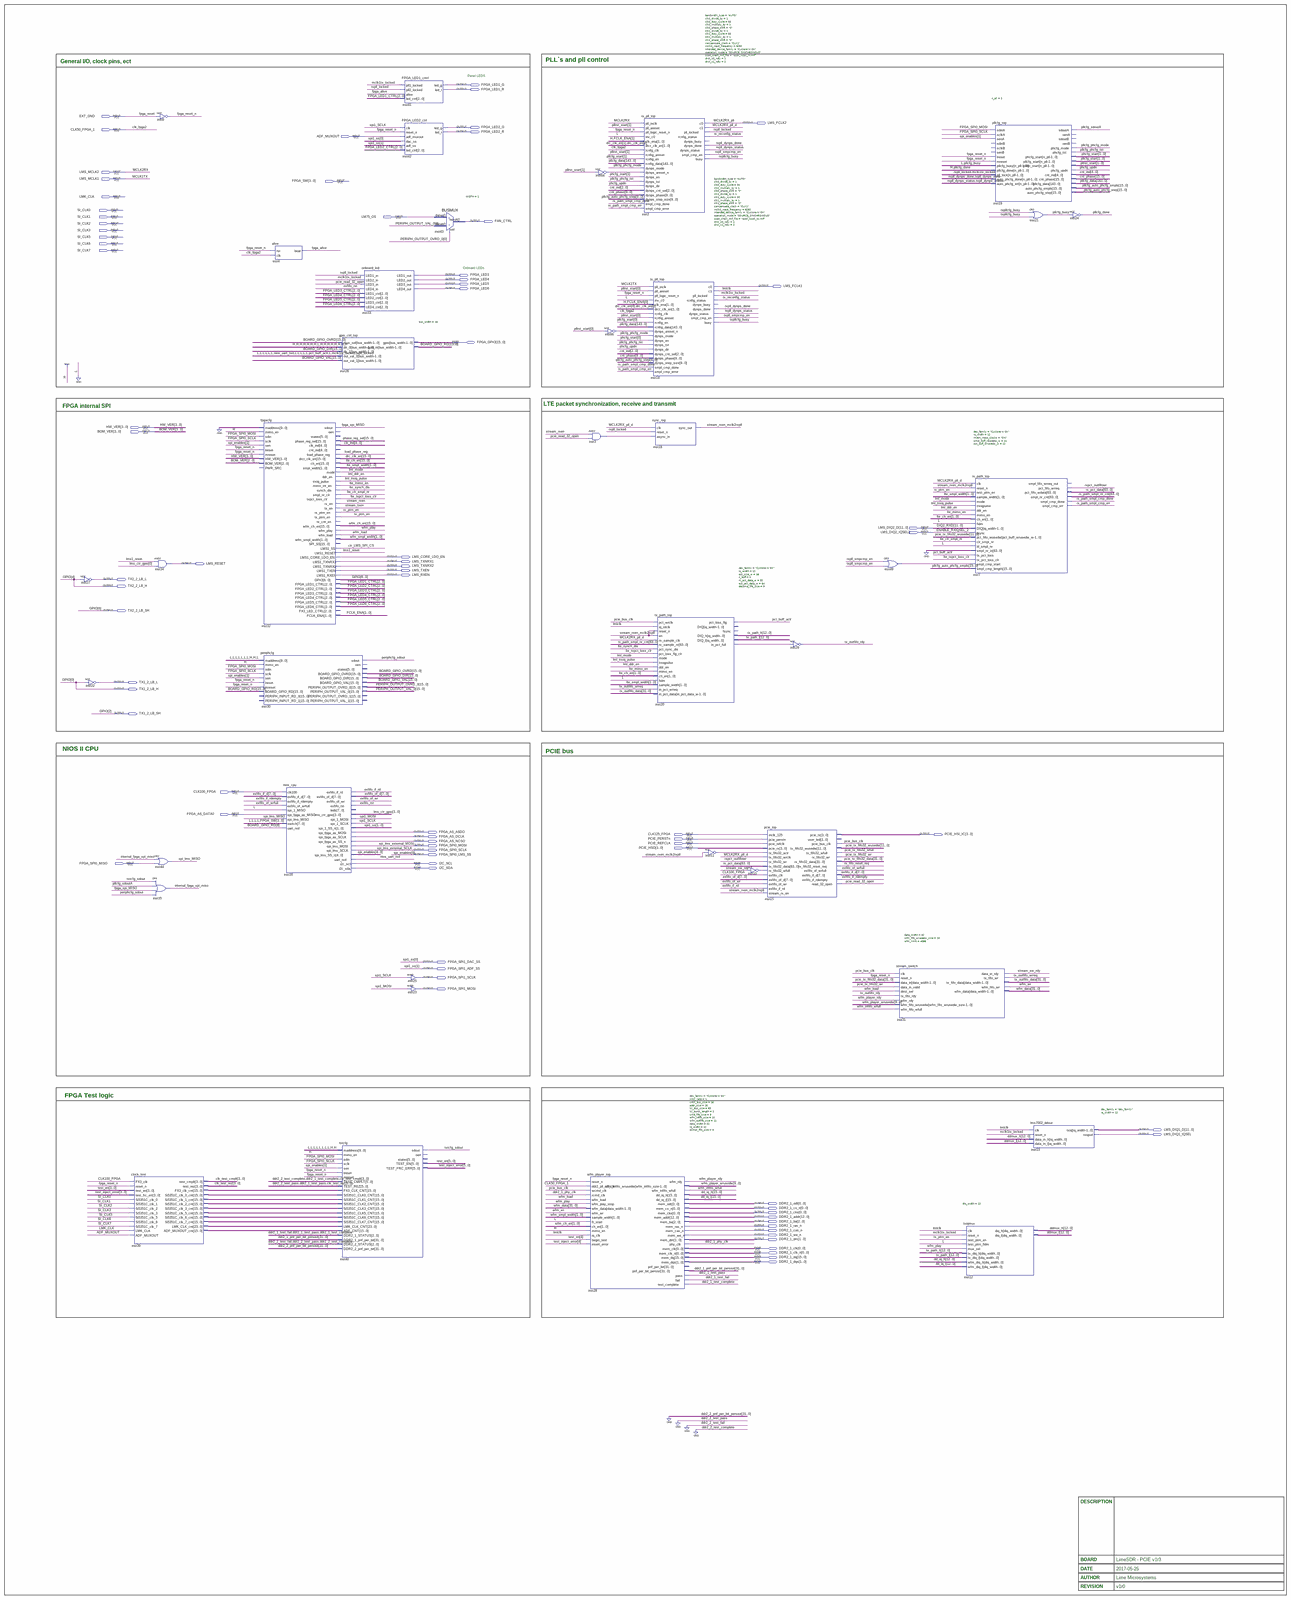
[diagram p0: schematic sheet, whole]
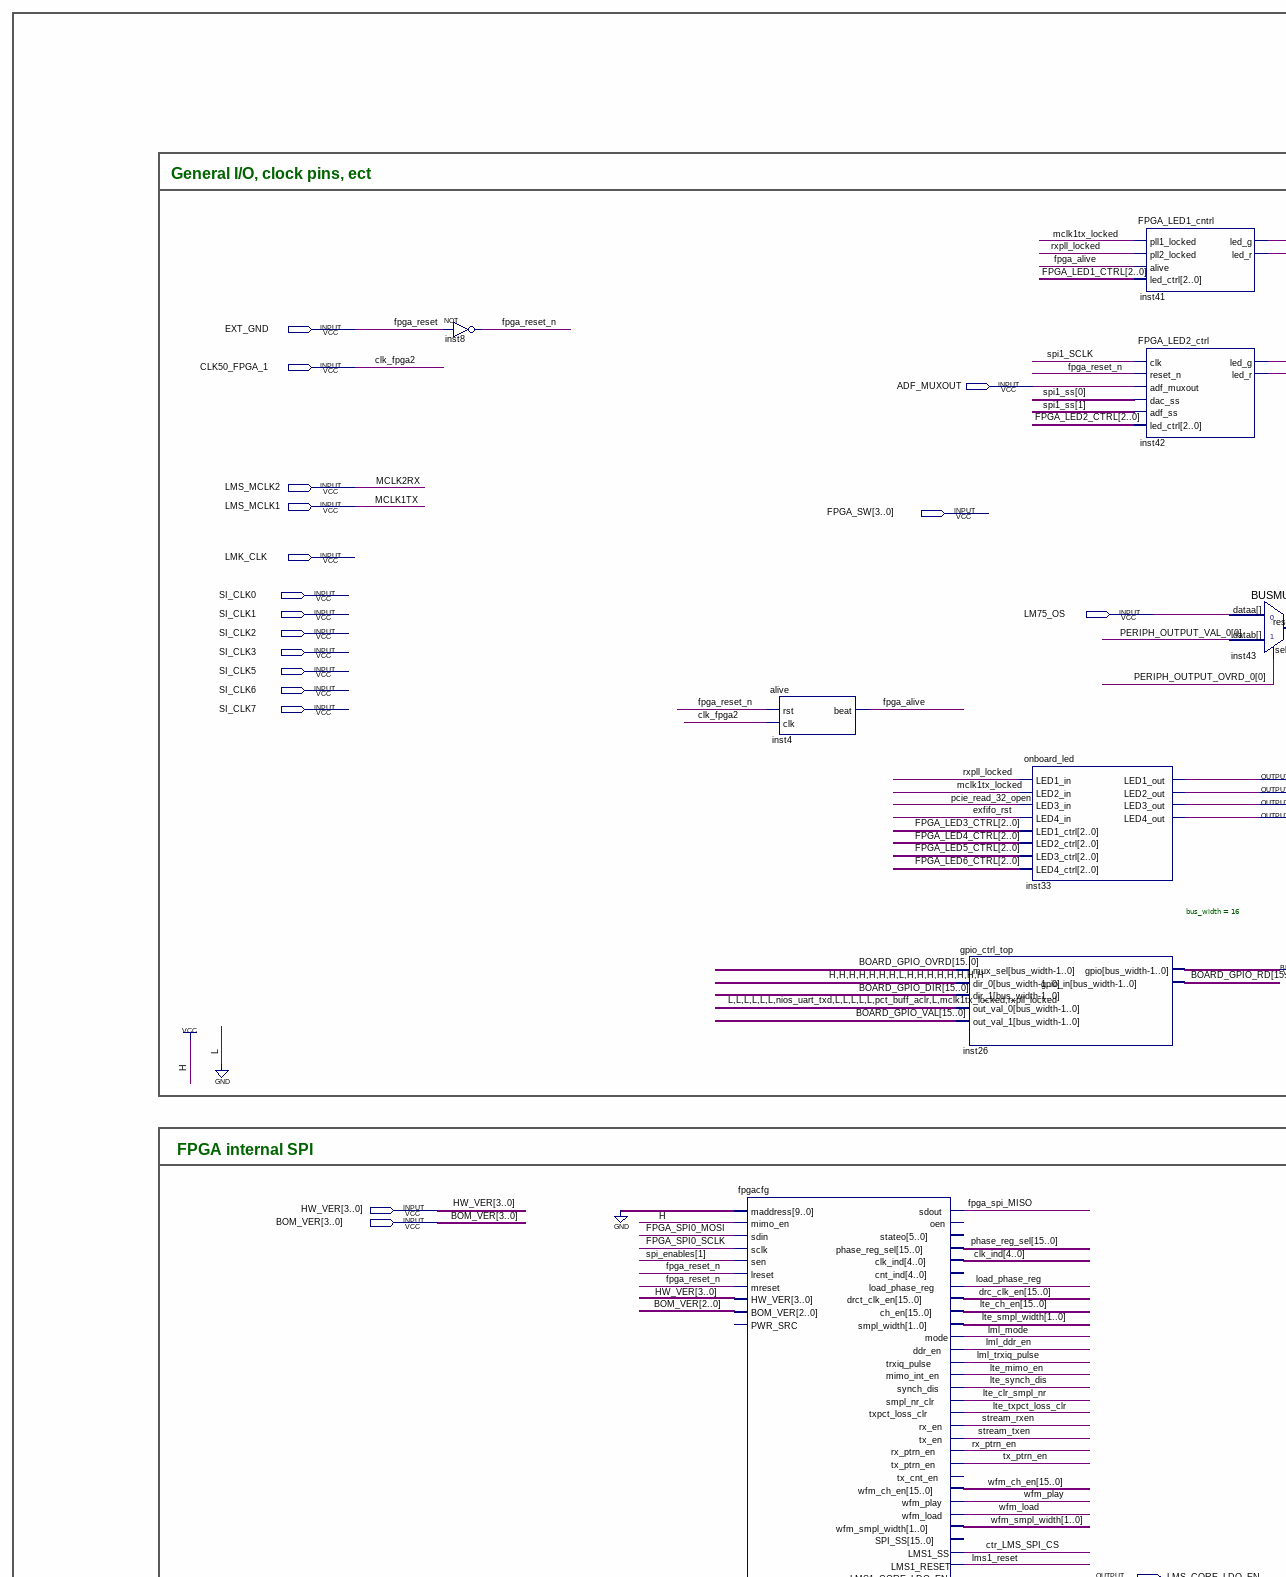
[diagram p1: schematic sheet, upper left part]
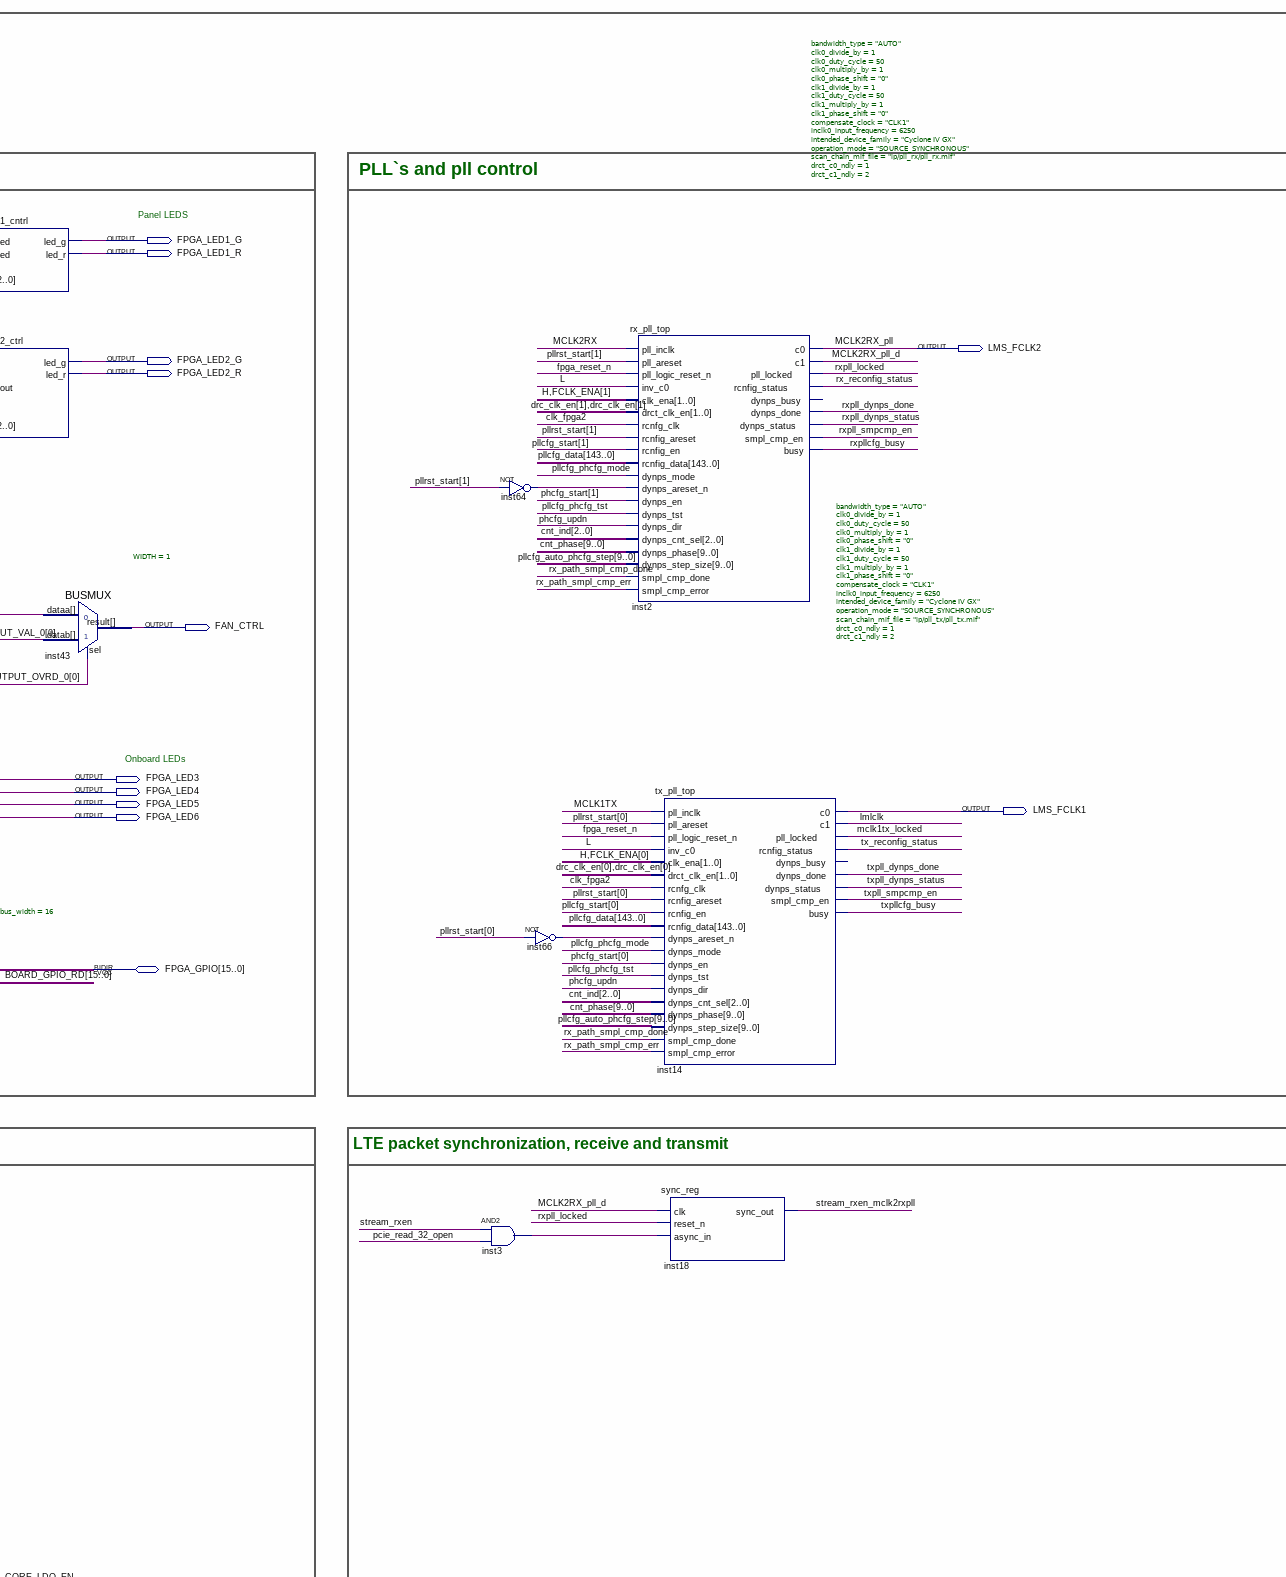
[diagram p2: schematic sheet, upper centre part]
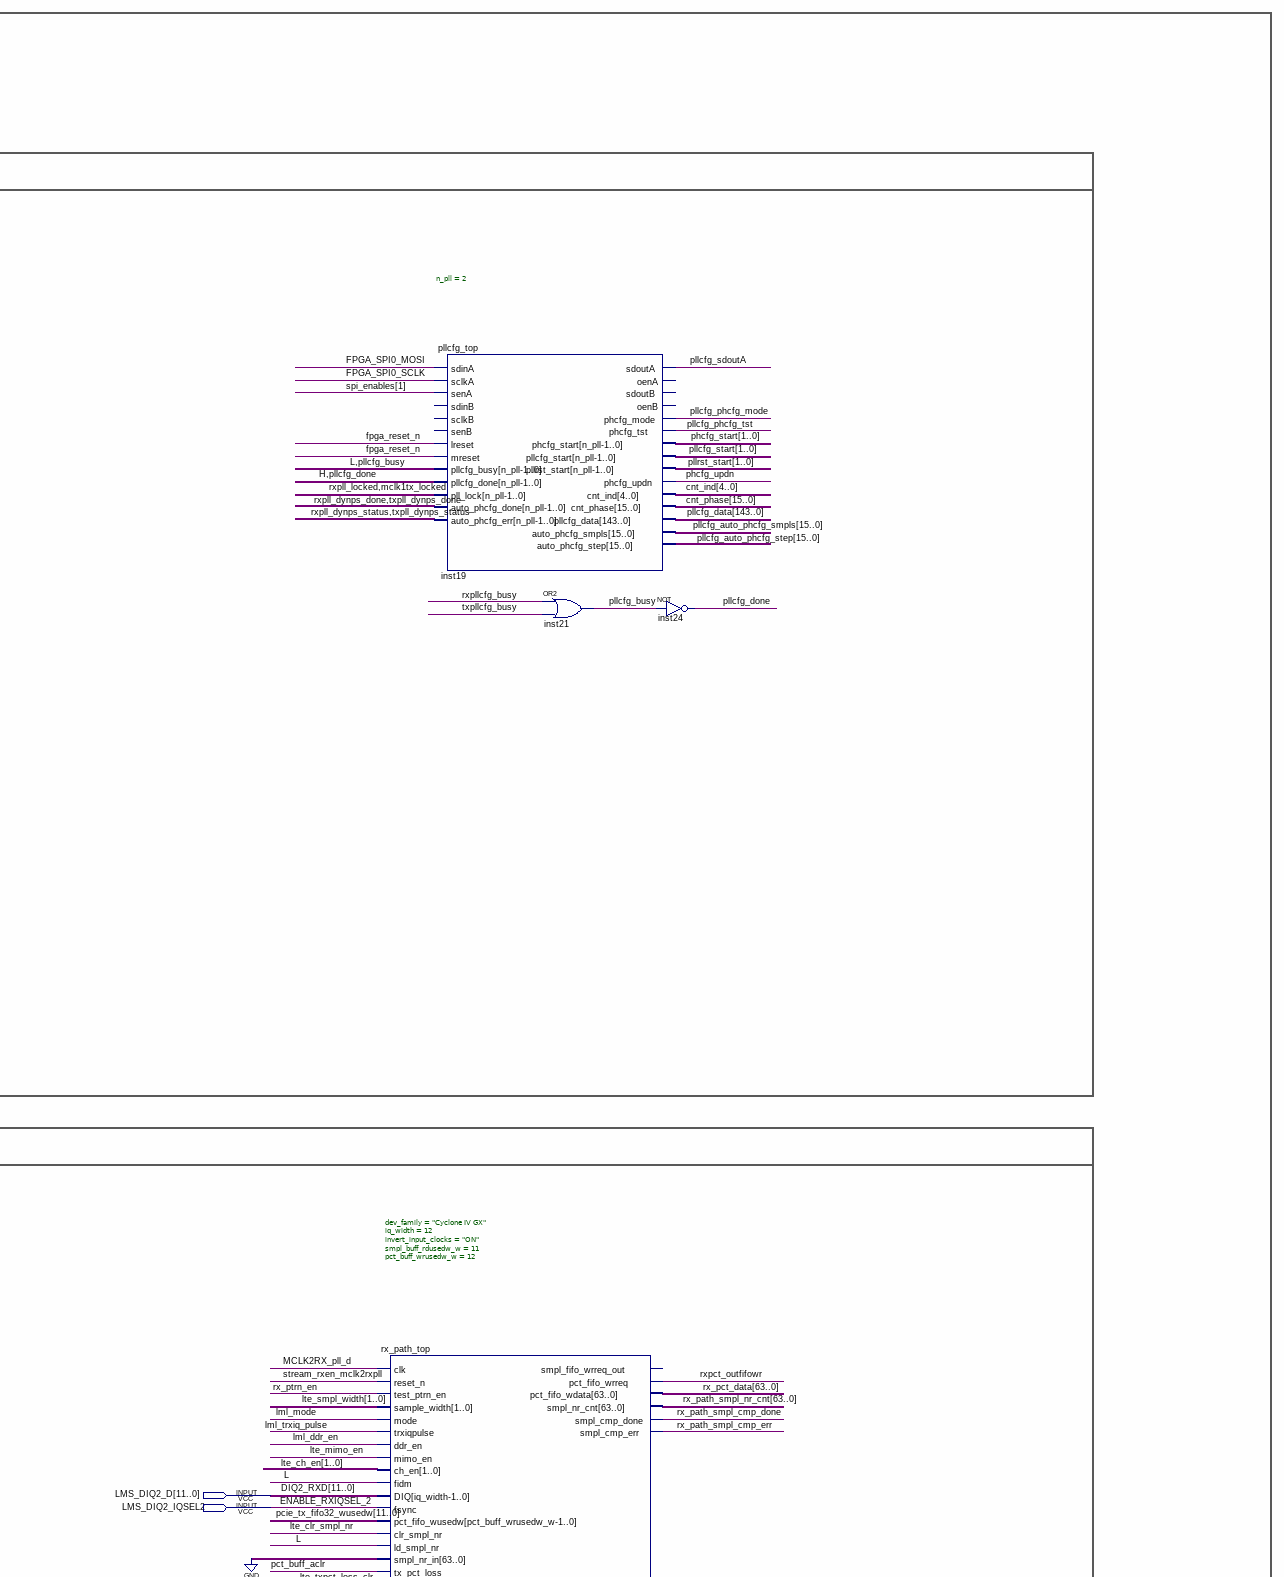
[diagram p3: schematic sheet, upper right part]
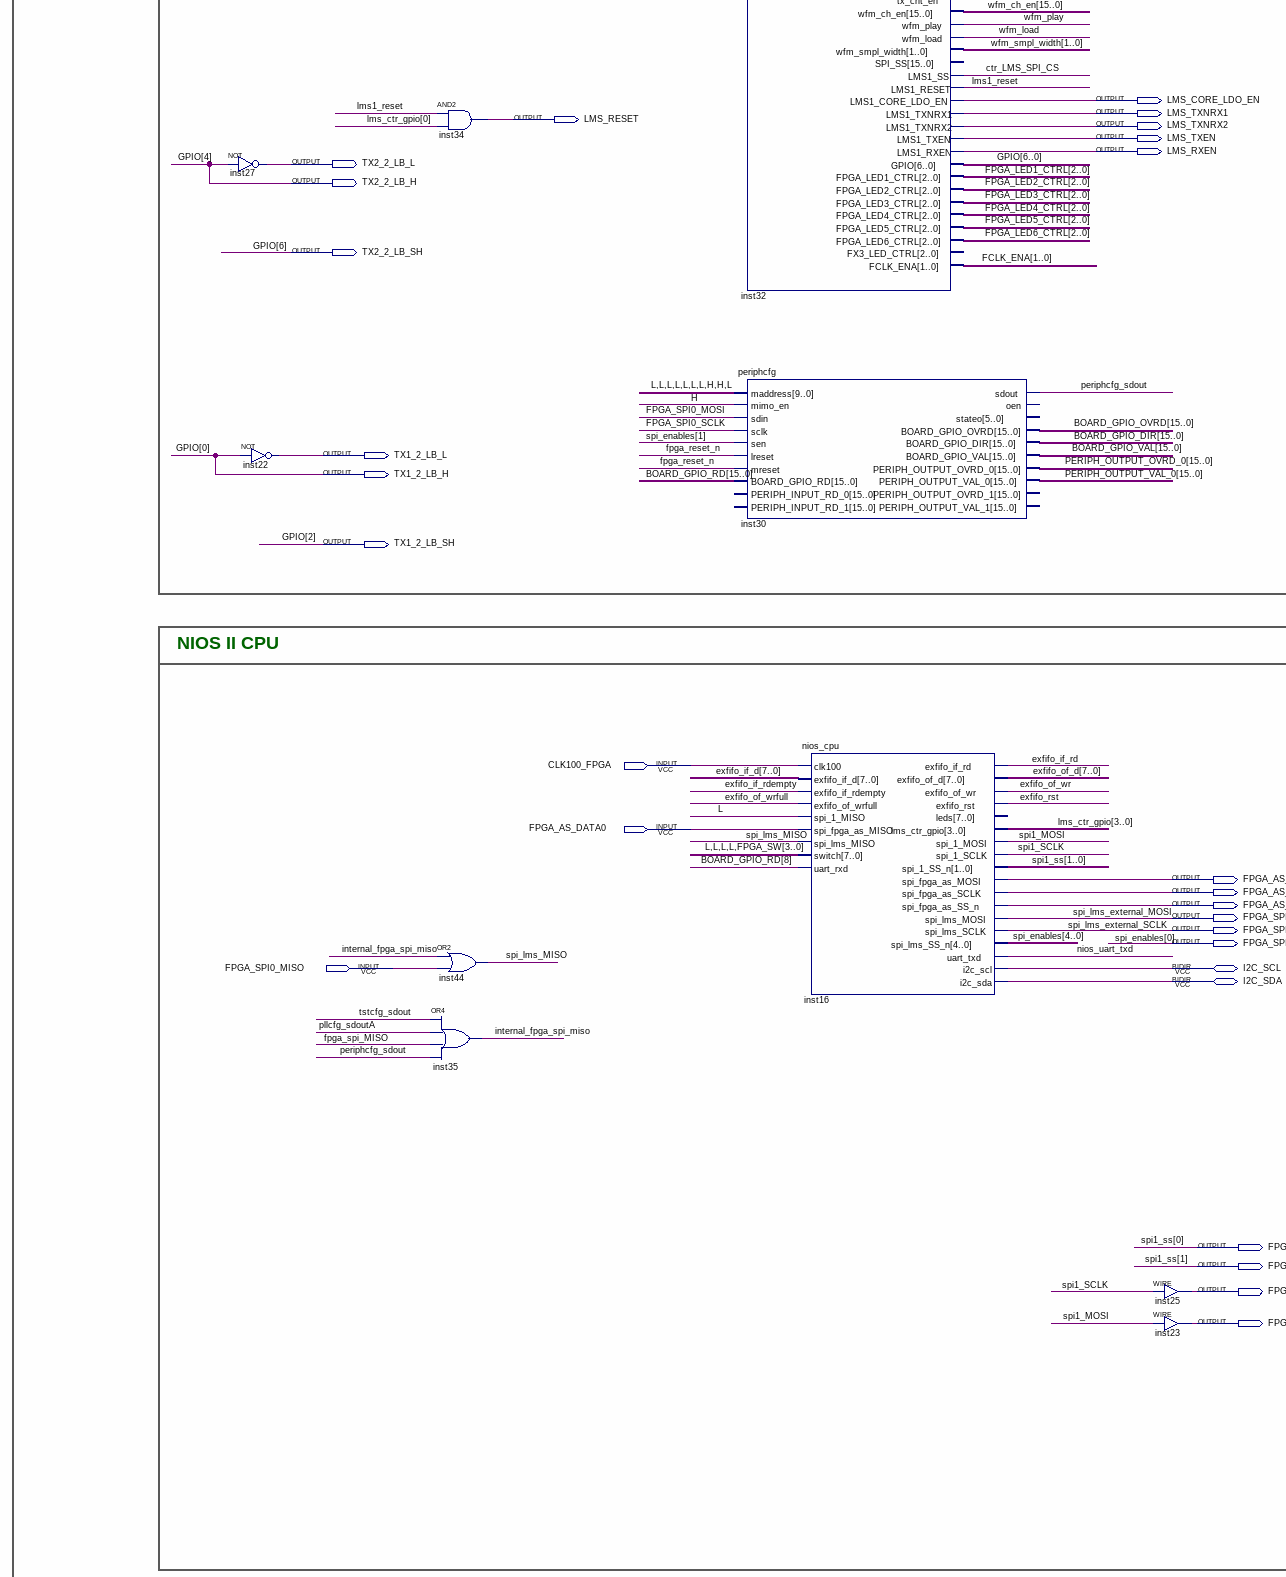
[diagram p4: schematic sheet, middle left part]
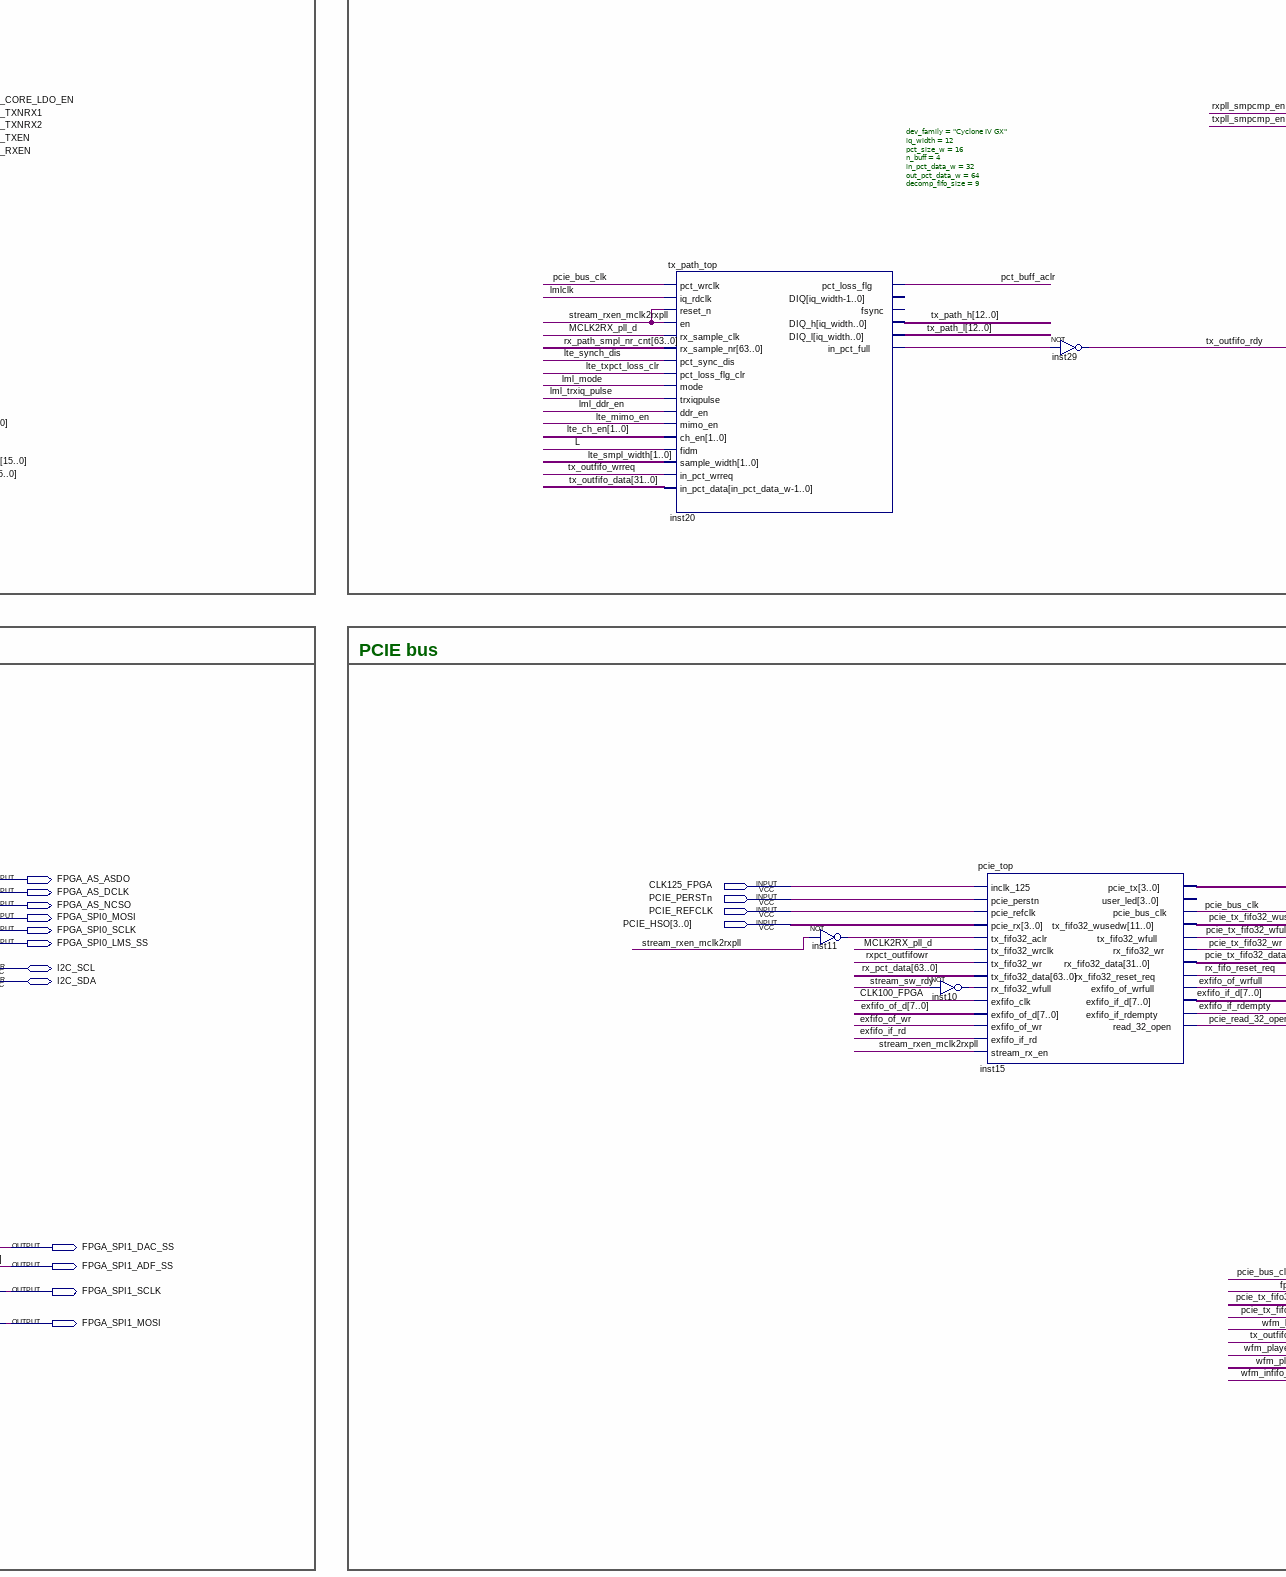
[diagram p5: schematic sheet, middle centre part]
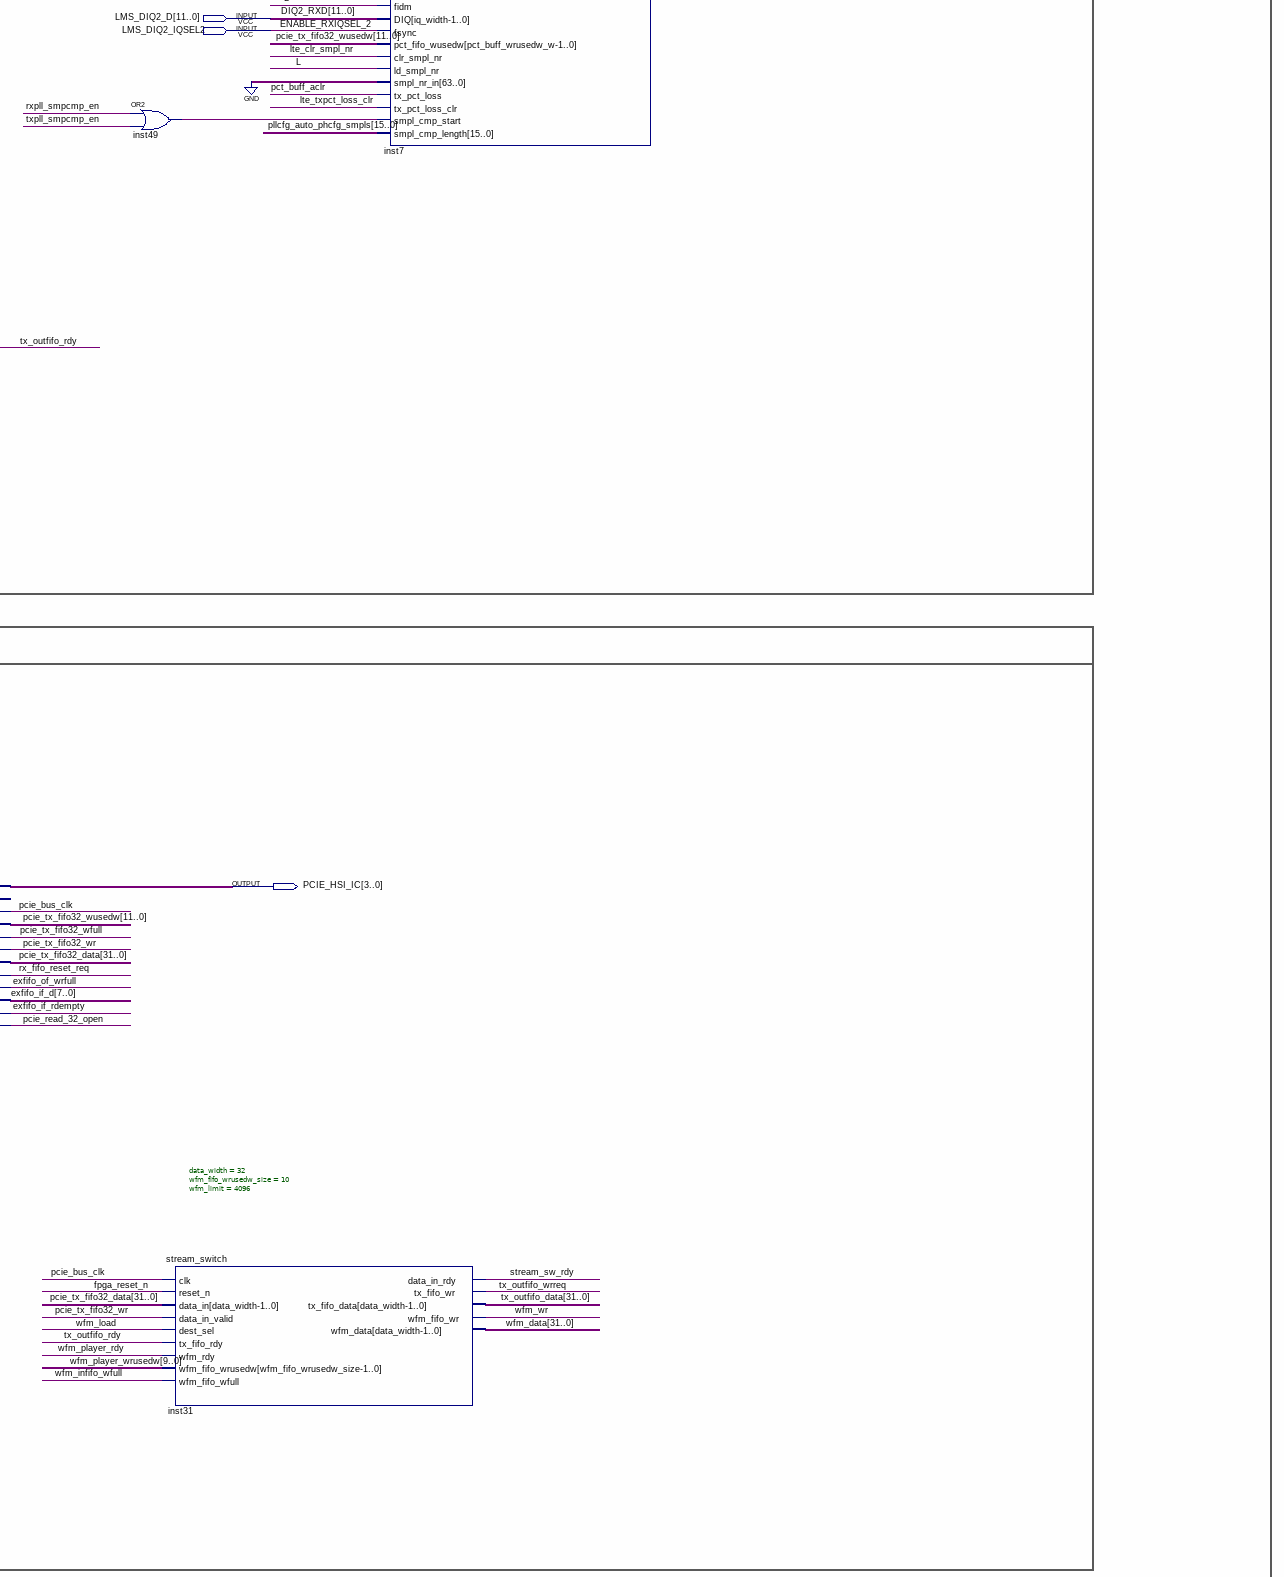
[diagram p6: schematic sheet, middle right part]
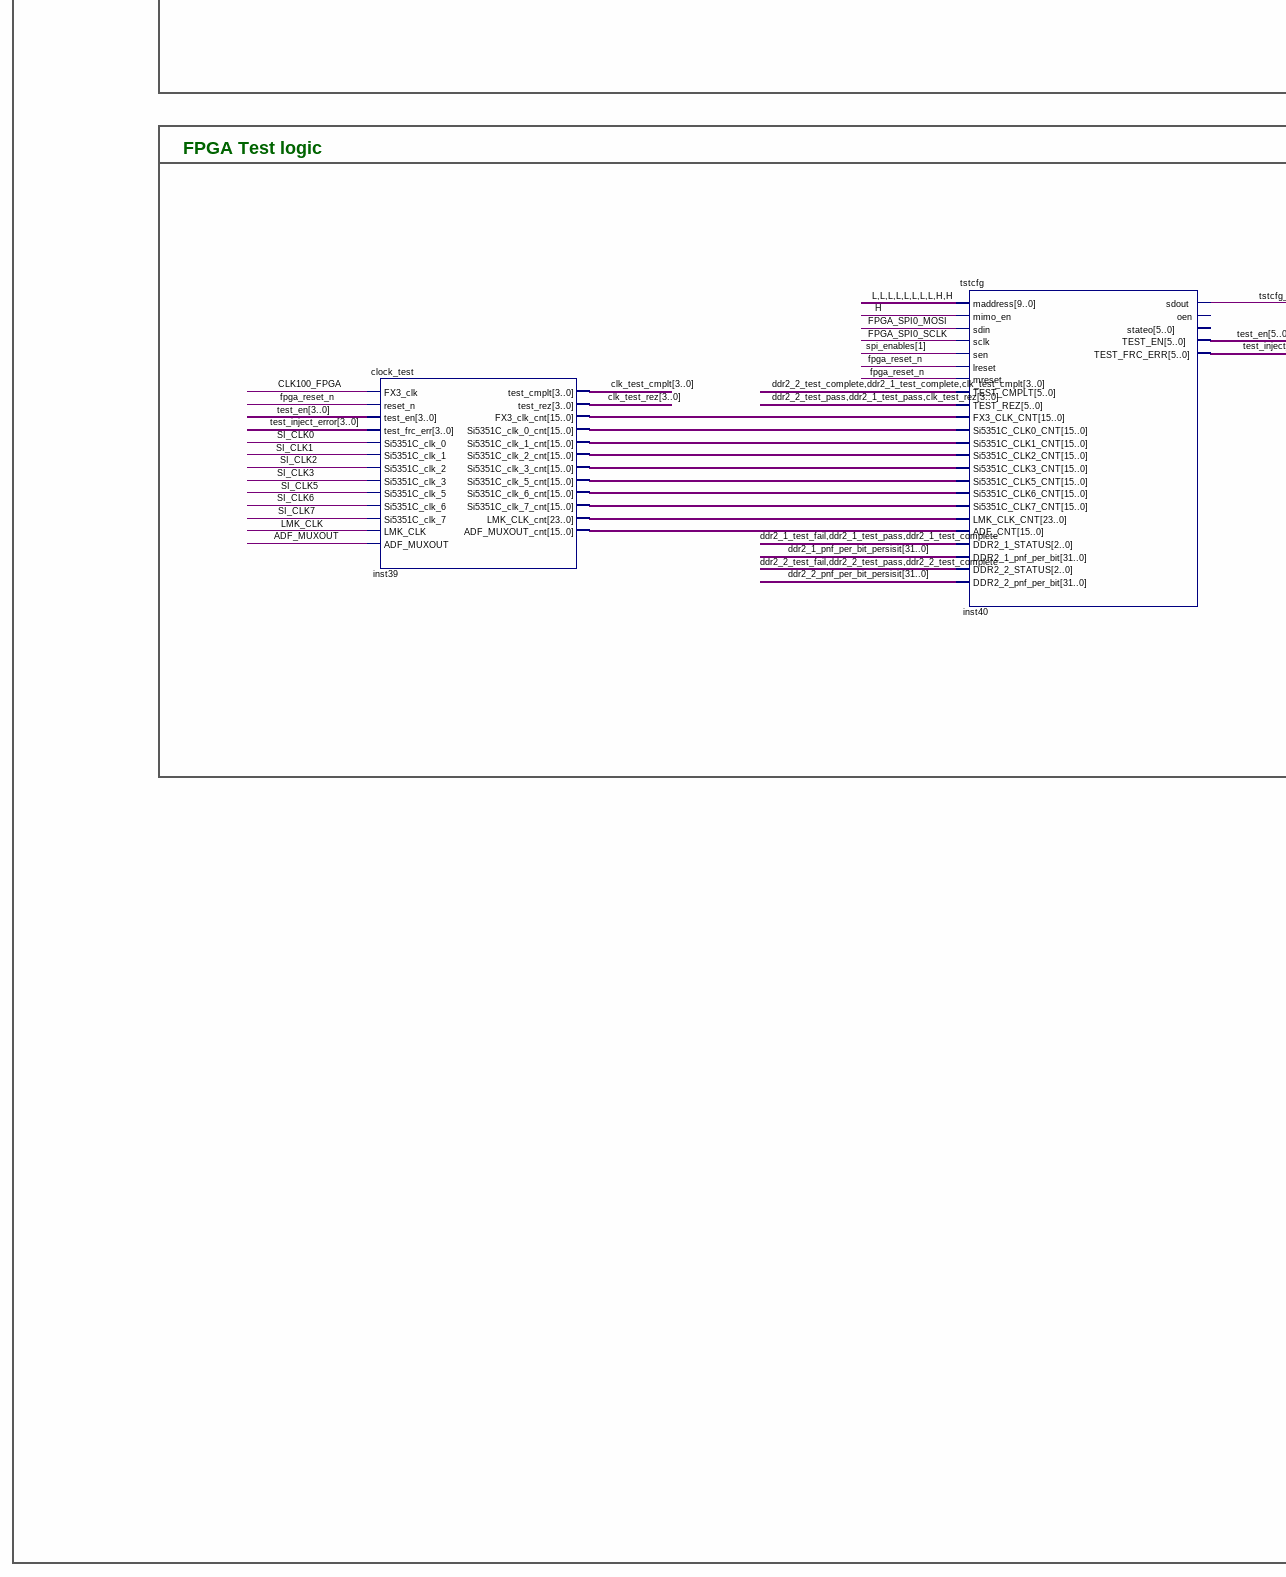
[diagram p7: schematic sheet, lower left part]
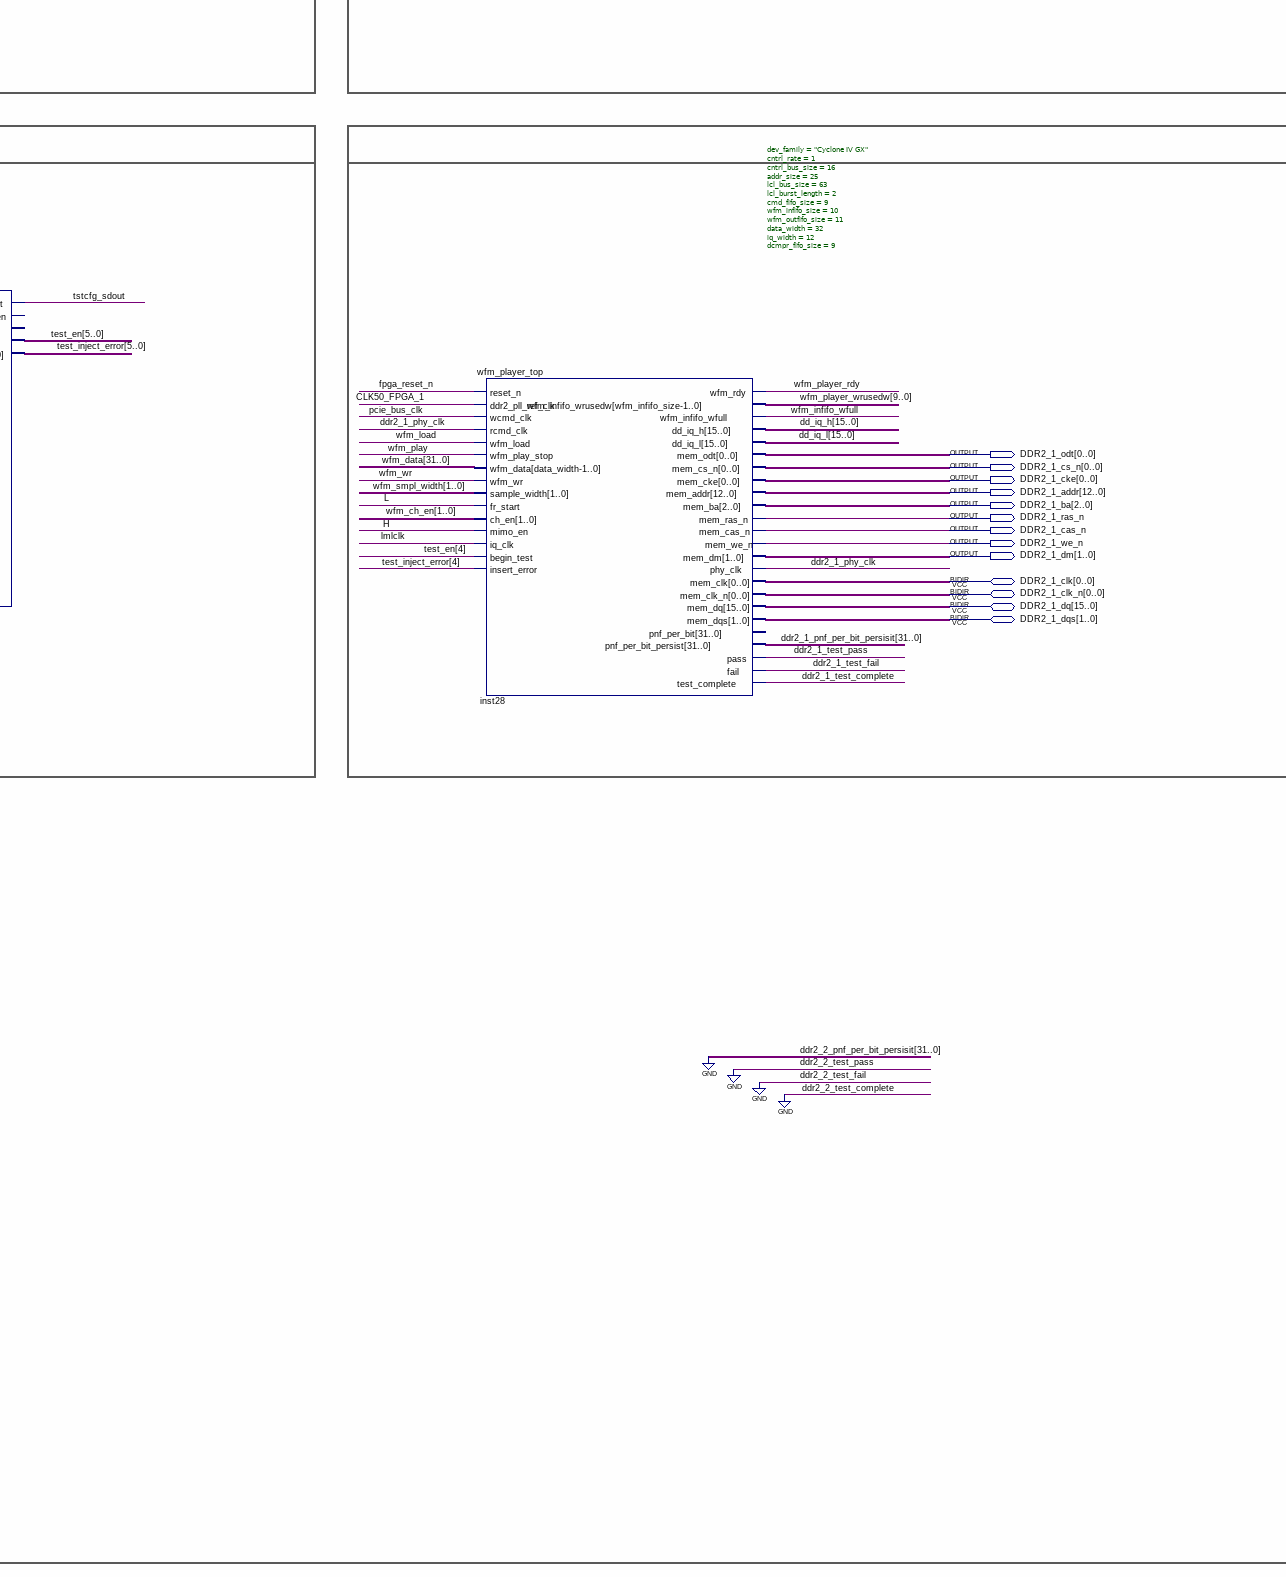
[diagram p8: schematic sheet, lower centre part]
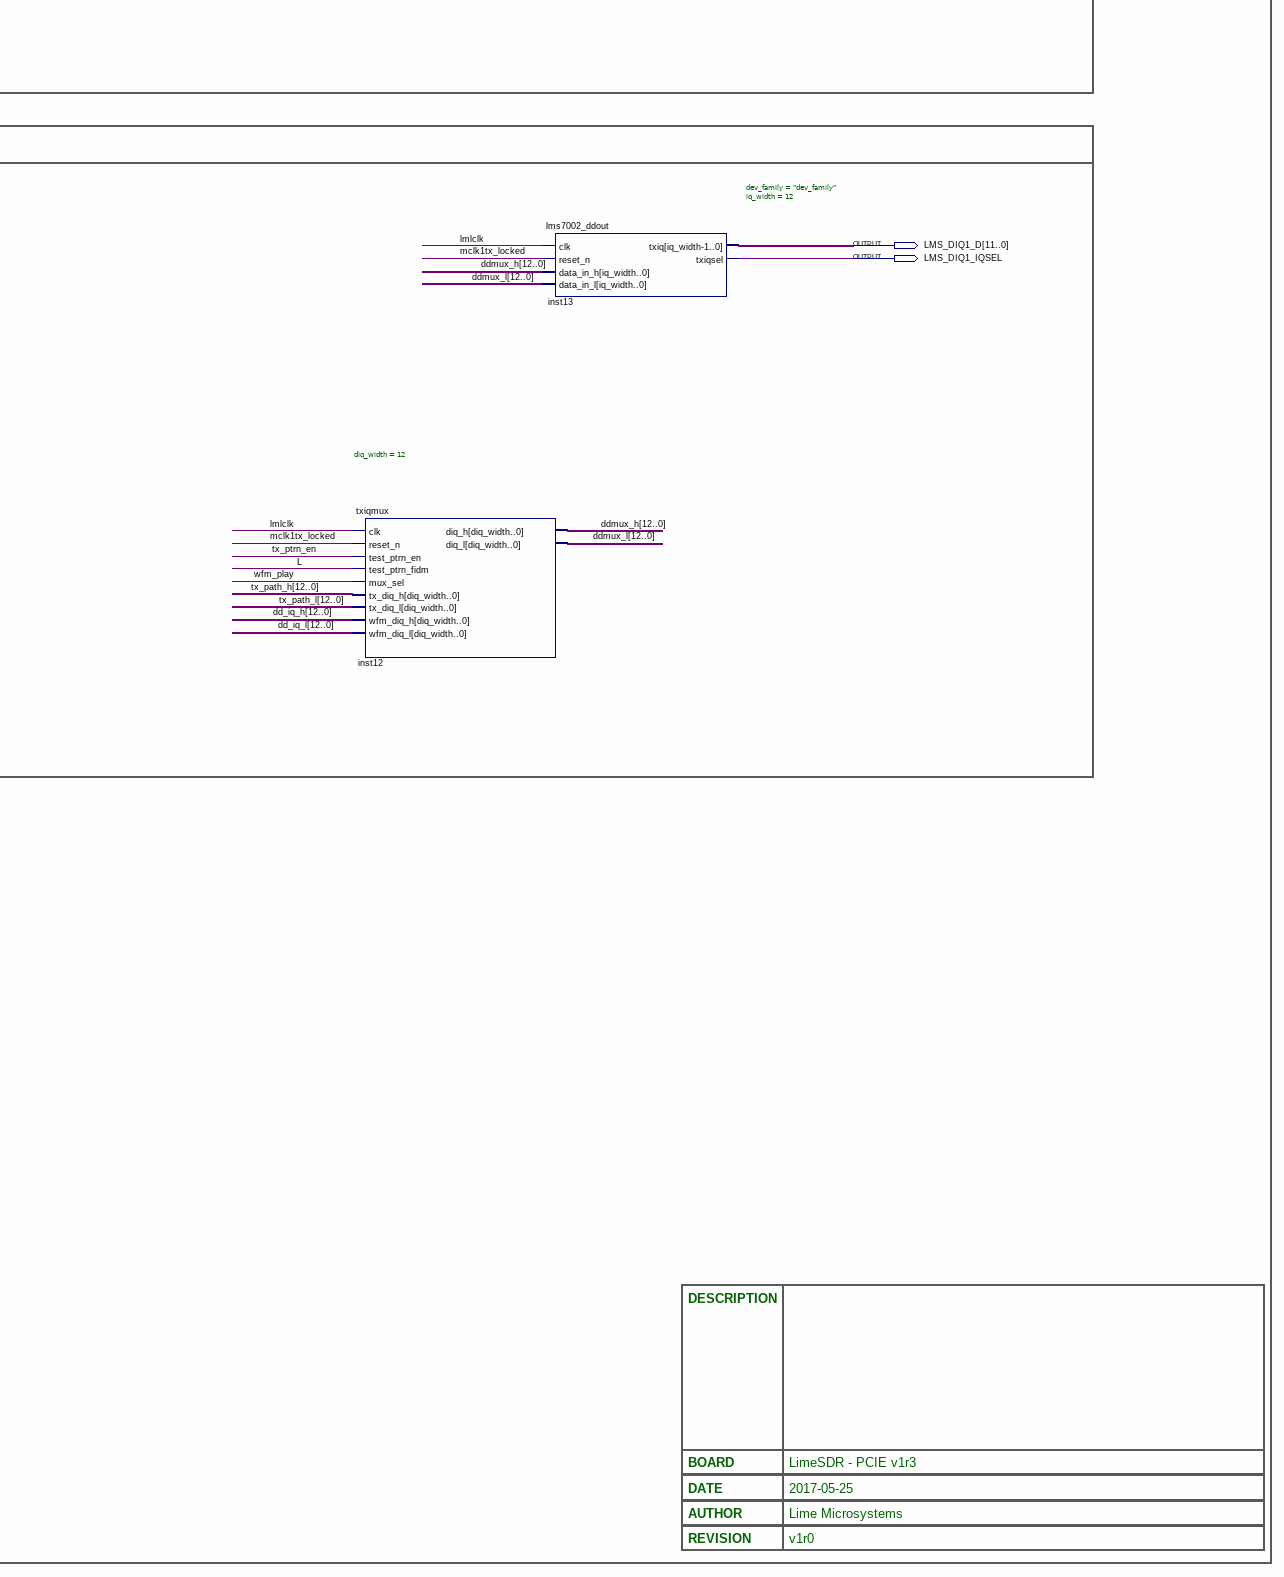
[diagram p9: schematic sheet, lower right part]
// Quartus schematic lms7_trx_top.bdf as structural Verilog: 39 symbols, 78 pins
module lms7_trx_top (
  input  EXT_GND,
  input  CLK50_FPGA_1,
  input  ADF_MUXOUT,
  input  LMS_MCLK2,
  input  LMS_MCLK1,
  input  [3:0] FPGA_SW,
  input  LMK_CLK,
  input  SI_CLK0,
  input  SI_CLK1,
  input  LM75_OS,
  input  SI_CLK2,
  input  SI_CLK3,
  input  SI_CLK5,
  input  SI_CLK6,
  input  SI_CLK7,
  input  [3:0] HW_VER,
  input  [3:0] BOM_VER,
  input  [11:0] LMS_DIQ2_D,
  input  LMS_DIQ2_IQSEL2,
  input  CLK100_FPGA,
  input  FPGA_AS_DATA0,
  input  CLK125_FPGA,
  input  PCIE_PERSTn,
  input  PCIE_REFCLK,
  input  [3:0] PCIE_HSO,
  input  FPGA_SPI0_MISO,
  inout  [15:0] FPGA_GPIO,
  inout  I2C_SCL,
  inout  I2C_SDA,
  inout  [0:0] DDR2_1_clk,
  inout  [0:0] DDR2_1_clk_n,
  inout  [15:0] DDR2_1_dq,
  inout  [1:0] DDR2_1_dqs,
  output FPGA_LED1_G,
  output FPGA_LED1_R,
  output LMS_FCLK2,
  output FPGA_LED2_G,
  output FPGA_LED2_R,
  output FAN_CTRL,
  output FPGA_LED3,
  output FPGA_LED4,
  output FPGA_LED5,
  output LMS_FCLK1,
  output FPGA_LED6,
  output LMS_CORE_LDO_EN,
  output LMS_TXNRX1,
  output LMS_RESET,
  output LMS_TXNRX2,
  output LMS_TXEN,
  output LMS_RXEN,
  output TX2_2_LB_L,
  output TX2_2_LB_H,
  output TX2_2_LB_SH,
  output TX1_2_LB_L,
  output TX1_2_LB_H,
  output TX1_2_LB_SH,
  output FPGA_AS_ASDO,
  output [3:0] PCIE_HSI_IC,
  output FPGA_AS_DCLK,
  output FPGA_AS_NCSO,
  output FPGA_SPI0_MOSI,
  output FPGA_SPI0_SCLK,
  output FPGA_SPI0_LMS_SS,
  output FPGA_SPI1_DAC_SS,
  output FPGA_SPI1_ADF_SS,
  output FPGA_SPI1_SCLK,
  output FPGA_SPI1_MOSI,
  output [11:0] LMS_DIQ1_D,
  output LMS_DIQ1_IQSEL,
  output [0:0] DDR2_1_odt,
  output [0:0] DDR2_1_cs_n,
  output [0:0] DDR2_1_cke,
  output [12:0] DDR2_1_addr,
  output [2:0] DDR2_1_ba,
  output DDR2_1_ras_n,
  output DDR2_1_cas_n,
  output DDR2_1_we_n,
  output [1:0] DDR2_1_dm
);

  wire ctr_LMS_SPI_CS, ddr2_1_phy_clk, ddr2_1_test_complete, ddr2_1_test_fail, ddr2_1_test_pass,
       exfifo_if_rd, exfifo_if_rdempty, exfifo_of_wr, exfifo_of_wrfull, exfifo_rst, fpga_alive, fpga_reset_n,
       fpga_spi_MISO, inst3_out, inst10_out, inst11_out, inst20_in_pct_full, inst49_out, inst64_out,
       inst66_out, internal_fpga_spi_miso, lml_ddr_en, lml_mode, lml_trxiq_pulse, lmlclk, lms1_reset,
       load_phase_reg, lte_clr_smpl_nr, lte_mimo_en, lte_synch_dis, lte_txpct_loss_clr, mclk1tx_locked,
       MCLK2RX_pll_d, nios_uart_txd, pcie_bus_clk, pcie_read_32_open, pcie_tx_fifo32_wfull,
       pcie_tx_fifo32_wr, pct_buff_aclr, periphcfg_sdout, phcfg_updn, pllcfg_busy, pllcfg_done,
       pllcfg_phcfg_mode, pllcfg_phcfg_tst, pllcfg_sdoutA, rx_fifo_reset_req, rx_path_smpl_cmp_done,
       rx_path_smpl_cmp_err, rx_ptrn_en, rx_reconfig_status, rxpct_outfifowr, rxpll_dynps_done,
       rxpll_dynps_status, rxpll_locked, rxpll_smpcmp_en, rxpllcfg_busy, spi1_MOSI, spi1_SCLK, spi_lms_MISO,
       stream_rxen, stream_rxen_mclk2rxpll, stream_sw_rdy, stream_txen, tstcfg_sdout, tx_outfifo_rdy,
       tx_outfifo_wrreq, tx_ptrn_en, tx_reconfig_status, txpll_dynps_done, txpll_dynps_status,
       txpll_smpcmp_en, txpllcfg_busy, wfm_infifo_wfull, wfm_load, wfm_play, wfm_player_rdy, wfm_wr;
  wire [1:0] FCLK_ENA, lte_smpl_width, phcfg_start, pllcfg_start, pllrst_start, wfm_smpl_width;
  wire [2:0] FPGA_LED1_CTRL, FPGA_LED2_CTRL, FPGA_LED3_CTRL, FPGA_LED4_CTRL, FPGA_LED5_CTRL, FPGA_LED6_CTRL;
  wire [3:0] clk_test_cmplt, clk_test_rez, lms_ctr_gpio;
  wire [4:0] clk_ind, cnt_ind;
  wire [4:1] spi_enables;
  wire [5:0] test_en, test_inject_error;
  wire [5:1] GPIO;
  wire [7:0] exfifo_if_d, exfifo_of_d;
  wire [9:0] wfm_player_wrusedw;
  wire [11:0] pcie_tx_fifo32_wusedw;
  wire [12:0] ddmux_h, ddmux_l, tx_path_h, tx_path_l;
  wire [15:0] BOARD_GPIO_DIR, BOARD_GPIO_OVRD, BOARD_GPIO_RD, BOARD_GPIO_VAL, cnt_phase, dd_iq_h, dd_iq_l,
       drc_clk_en, inst39_adf_muxout_cnt, inst39_fx3_clk_cnt, inst39_si5351c_clk_0_cnt,
       inst39_si5351c_clk_1_cnt, inst39_si5351c_clk_2_cnt, inst39_si5351c_clk_3_cnt,
       inst39_si5351c_clk_5_cnt, inst39_si5351c_clk_6_cnt, inst39_si5351c_clk_7_cnt, lte_ch_en,
       PERIPH_OUTPUT_OVRD_0, PERIPH_OUTPUT_VAL_0, phase_reg_sel, pllcfg_auto_phcfg_smpls,
       pllcfg_auto_phcfg_step, wfm_ch_en;
  wire [23:0] inst39_lmk_clk_cnt;
  wire [31:0] ddr2_1_pnf_per_bit_persisit, pcie_tx_fifo32_data, tx_outfifo_data, wfm_data;
  wire [63:0] rx_path_smpl_nr_cnt, rx_pct_data;
  wire [143:0] pllcfg_data;

  not inst27 (TX2_2_LB_L, TX2_2_LB_H);
  not inst22 (TX1_2_LB_L, TX1_2_LB_H);
  clock_test inst39 (
    .FX3_clk(CLK100_FPGA), .reset_n(fpga_reset_n), .test_en(test_en[3:0]),
    .test_frc_err(test_inject_error[3:0]), .Si5351C_clk_0(SI_CLK0), .Si5351C_clk_1(SI_CLK1),
    .Si5351C_clk_2(SI_CLK2), .Si5351C_clk_3(SI_CLK3), .Si5351C_clk_5(SI_CLK5), .Si5351C_clk_6(SI_CLK6),
    .Si5351C_clk_7(SI_CLK7), .LMK_CLK(LMK_CLK), .ADF_MUXOUT(ADF_MUXOUT), .test_cmplt(clk_test_cmplt),
    .test_rez(clk_test_rez), .FX3_clk_cnt(inst39_fx3_clk_cnt), .Si5351C_clk_0_cnt(inst39_si5351c_clk_0_cnt),
    .Si5351C_clk_1_cnt(inst39_si5351c_clk_1_cnt), .Si5351C_clk_2_cnt(inst39_si5351c_clk_2_cnt),
    .Si5351C_clk_3_cnt(inst39_si5351c_clk_3_cnt), .Si5351C_clk_5_cnt(inst39_si5351c_clk_5_cnt),
    .Si5351C_clk_6_cnt(inst39_si5351c_clk_6_cnt), .Si5351C_clk_7_cnt(inst39_si5351c_clk_7_cnt),
    .LMK_CLK_cnt(inst39_lmk_clk_cnt), .ADF_MUXOUT_cnt(inst39_adf_muxout_cnt));
  not inst8 (fpga_reset_n, EXT_GND);
  and inst34 (LMS_RESET, lms1_reset, lms_ctr_gpio[0]);
  or inst44 (spi_lms_MISO, internal_fpga_spi_miso, FPGA_SPI0_MISO);
  or inst35 (internal_fpga_spi_miso, tstcfg_sdout, pllcfg_sdoutA, fpga_spi_MISO, periphcfg_sdout);
  fpgacfg inst32 (
    .maddress({10{1'b0}}), .mimo_en(1'b1), .sdin(FPGA_SPI0_MOSI), .sclk(FPGA_SPI0_SCLK),
    .sen(spi_enables[1]), .lreset(fpga_reset_n), .mreset(fpga_reset_n), .HW_VER(HW_VER),
    .BOM_VER(BOM_VER[2:0]), .sdout(fpga_spi_MISO), .phase_reg_sel(phase_reg_sel), .clk_ind(clk_ind),
    .load_phase_reg(load_phase_reg), .drct_clk_en(drc_clk_en), .ch_en(lte_ch_en),
    .smpl_width(lte_smpl_width), .mode(lml_mode), .ddr_en(lml_ddr_en), .trxiq_pulse(lml_trxiq_pulse),
    .mimo_int_en(lte_mimo_en), .synch_dis(lte_synch_dis), .smpl_nr_clr(lte_clr_smpl_nr),
    .txpct_loss_clr(lte_txpct_loss_clr), .rx_en(stream_rxen), .tx_en(stream_txen), .rx_ptrn_en(rx_ptrn_en),
    .tx_ptrn_en(tx_ptrn_en), .wfm_ch_en(wfm_ch_en), .wfm_play(wfm_play), .wfm_load(wfm_load),
    .wfm_smpl_width(wfm_smpl_width), .LMS1_SS(ctr_LMS_SPI_CS), .LMS1_RESET(lms1_reset),
    .LMS1_CORE_LDO_EN(LMS_CORE_LDO_EN), .LMS1_TXNRX1(LMS_TXNRX1), .LMS1_TXNRX2(LMS_TXNRX2),
    .LMS1_TXEN(LMS_TXEN), .LMS1_RXEN(LMS_RXEN),
    .GPIO({TX2_2_LB_SH, GPIO[5], TX2_2_LB_H, GPIO[3], TX1_2_LB_SH, GPIO[1], TX1_2_LB_H}),
    .FPGA_LED1_CTRL(FPGA_LED1_CTRL), .FPGA_LED2_CTRL(FPGA_LED2_CTRL), .FPGA_LED3_CTRL(FPGA_LED3_CTRL),
    .FPGA_LED4_CTRL(FPGA_LED4_CTRL), .FPGA_LED5_CTRL(FPGA_LED5_CTRL), .FPGA_LED6_CTRL(FPGA_LED6_CTRL),
    .FCLK_ENA(FCLK_ENA));  // open: PWR_SRC, oen, stateo, cnt_ind, tx_cnt_en, SPI_SS, FX3_LED_CTRL
  periphcfg inst30 (
    .maddress(10'b0000000110), .mimo_en(1'b1), .sdin(FPGA_SPI0_MOSI), .sclk(FPGA_SPI0_SCLK),
    .sen(spi_enables[1]), .lreset(fpga_reset_n), .mreset(fpga_reset_n), .BOARD_GPIO_RD(BOARD_GPIO_RD),
    .sdout(periphcfg_sdout), .BOARD_GPIO_OVRD(BOARD_GPIO_OVRD), .BOARD_GPIO_DIR(BOARD_GPIO_DIR),
    .BOARD_GPIO_VAL(BOARD_GPIO_VAL), .PERIPH_OUTPUT_OVRD_0(PERIPH_OUTPUT_OVRD_0),
    .PERIPH_OUTPUT_VAL_0(PERIPH_OUTPUT_VAL_0));  // open: PERIPH_INPUT_RD_0, PERIPH_INPUT_RD_1, oen, stateo, PERIPH_OUTPUT_OVRD_1, PERIPH_OUTPUT_VAL_1
  alive inst4 (.rst(fpga_reset_n), .clk(CLK50_FPGA_1), .beat(fpga_alive));
  nios_cpu inst16 (
    .clk100(CLK100_FPGA), .exfifo_if_d(exfifo_if_d), .exfifo_if_rdempty(exfifo_if_rdempty),
    .exfifo_of_wrfull(exfifo_of_wrfull), .spi_1_MISO(1'b0), .spi_fpga_as_MISO(FPGA_AS_DATA0),
    .spi_lms_MISO(spi_lms_MISO), .switch({4'b0000, FPGA_SW}), .uart_rxd(BOARD_GPIO_RD[8]),
    .exfifo_if_rd(exfifo_if_rd), .exfifo_of_d(exfifo_of_d), .exfifo_of_wr(exfifo_of_wr),
    .exfifo_rst(exfifo_rst), .lms_ctr_gpio(lms_ctr_gpio), .spi_1_MOSI(spi1_MOSI), .spi_1_SCLK(spi1_SCLK),
    .spi_1_SS_n({FPGA_SPI1_ADF_SS, FPGA_SPI1_DAC_SS}), .spi_fpga_as_MOSI(FPGA_AS_ASDO),
    .spi_fpga_as_SCLK(FPGA_AS_DCLK), .spi_fpga_as_SS_n(FPGA_AS_NCSO), .spi_lms_MOSI(FPGA_SPI0_MOSI),
    .spi_lms_SCLK(FPGA_SPI0_SCLK), .spi_lms_SS_n({spi_enables, FPGA_SPI0_LMS_SS}), .uart_txd(nios_uart_txd),
    .i2c_scl(I2C_SCL), .i2c_sda(I2C_SDA));  // open: leds
  gpio_ctrl_top #(.bus_width(16)) inst26 (
    .mux_sel(BOARD_GPIO_OVRD), .dir_0(16'b1111111011111111), .dir_1(BOARD_GPIO_DIR),
    .out_val_0({{6{1'b0}}, nios_uart_txd, {5{1'b0}}, pct_buff_aclr, 1'b0, mclk1tx_locked, rxpll_locked}),
    .out_val_1(BOARD_GPIO_VAL), .gpio_in(BOARD_GPIO_RD), .gpio(FPGA_GPIO));
  tstcfg inst40 (
    .maddress(10'b0000000011), .mimo_en(1'b1), .sdin(FPGA_SPI0_MOSI), .sclk(FPGA_SPI0_SCLK),
    .sen(spi_enables[1]), .lreset(fpga_reset_n), .mreset(fpga_reset_n),
    .TEST_CMPLT({1'b0, ddr2_1_test_complete, clk_test_cmplt}),
    .TEST_REZ({1'b0, ddr2_1_test_pass, clk_test_rez}), .FX3_CLK_CNT(inst39_fx3_clk_cnt),
    .Si5351C_CLK0_CNT(inst39_si5351c_clk_0_cnt), .Si5351C_CLK1_CNT(inst39_si5351c_clk_1_cnt),
    .Si5351C_CLK2_CNT(inst39_si5351c_clk_2_cnt), .Si5351C_CLK3_CNT(inst39_si5351c_clk_3_cnt),
    .Si5351C_CLK5_CNT(inst39_si5351c_clk_5_cnt), .Si5351C_CLK6_CNT(inst39_si5351c_clk_6_cnt),
    .Si5351C_CLK7_CNT(inst39_si5351c_clk_7_cnt), .LMK_CLK_CNT(inst39_lmk_clk_cnt),
    .ADF_CNT(inst39_adf_muxout_cnt),
    .DDR2_1_STATUS({ddr2_1_test_fail, ddr2_1_test_pass, ddr2_1_test_complete}),
    .DDR2_1_pnf_per_bit(ddr2_1_pnf_per_bit_persisit), .DDR2_2_STATUS(3'b000),
    .DDR2_2_pnf_per_bit({32{1'b0}}), .sdout(tstcfg_sdout), .TEST_EN(test_en), .TEST_FRC_ERR(test_inject_error));  // open: oen, stateo
  onboard_led inst33 (
    .LED1_in(rxpll_locked), .LED2_in(mclk1tx_locked), .LED3_in(pcie_read_32_open), .LED4_in(exfifo_rst),
    .LED1_ctrl(FPGA_LED3_CTRL), .LED2_ctrl(FPGA_LED4_CTRL), .LED3_ctrl(FPGA_LED5_CTRL),
    .LED4_ctrl(FPGA_LED6_CTRL), .LED1_out(FPGA_LED3), .LED2_out(FPGA_LED4), .LED3_out(FPGA_LED5),
    .LED4_out(FPGA_LED6));
  FPGA_LED1_cntrl inst41 (
    .pll1_locked(mclk1tx_locked), .pll2_locked(rxpll_locked), .alive(fpga_alive), .led_ctrl(FPGA_LED1_CTRL),
    .led_g(FPGA_LED1_G), .led_r(FPGA_LED1_R));
  FPGA_LED2_ctrl inst42 (
    .clk(spi1_SCLK), .reset_n(fpga_reset_n), .adf_muxout(ADF_MUXOUT), .dac_ss(FPGA_SPI1_DAC_SS),
    .adf_ss(FPGA_SPI1_ADF_SS), .led_ctrl(FPGA_LED2_CTRL), .led_g(FPGA_LED2_G), .led_r(FPGA_LED2_R));
  assign FPGA_SPI1_SCLK = spi1_SCLK;  // WIRE inst25
  assign FPGA_SPI1_MOSI = spi1_MOSI;  // WIRE inst23
  BUSMUX #(.WIDTH(1)) inst43 (
    .datab(PERIPH_OUTPUT_VAL_0[0]), .sel(PERIPH_OUTPUT_OVRD_0[0]), .dataa(LM75_OS), .result(FAN_CTRL));
  wfm_player_top #(.dev_family("Cyclone IV GX"), .cntrl_rate(1), .cntrl_bus_size(16), .addr_size(25), .lcl_bus_size(63), .lcl_burst_length(2), .cmd_fifo_size(9), .wfm_infifo_size(10), .wfm_outfifo_size(11), .data_width(32), .iq_width(12), .dcmpr_fifo_size(9)) inst28 (
    .reset_n(fpga_reset_n), .ddr2_pll_ref_clk(CLK50_FPGA_1), .wcmd_clk(pcie_bus_clk),
    .rcmd_clk(ddr2_1_phy_clk), .wfm_load(wfm_load), .wfm_play_stop(wfm_play), .wfm_data(wfm_data),
    .wfm_wr(wfm_wr), .sample_width(wfm_smpl_width), .fr_start(1'b0), .ch_en(wfm_ch_en[1:0]), .mimo_en(1'b1),
    .iq_clk(lmlclk), .begin_test(test_en[4]), .insert_error(test_inject_error[4]), .wfm_rdy(wfm_player_rdy),
    .wfm_infifo_wrusedw(wfm_player_wrusedw), .wfm_infifo_wfull(wfm_infifo_wfull), .dd_iq_h(dd_iq_h),
    .dd_iq_l(dd_iq_l), .mem_odt(DDR2_1_odt[0]), .mem_cs_n(DDR2_1_cs_n[0]), .mem_cke(DDR2_1_cke[0]),
    .mem_addr(DDR2_1_addr), .mem_ba(DDR2_1_ba), .mem_ras_n(DDR2_1_ras_n), .mem_cas_n(DDR2_1_cas_n),
    .mem_we_n(DDR2_1_we_n), .mem_dm(DDR2_1_dm), .phy_clk(ddr2_1_phy_clk),
    .pnf_per_bit_persist(ddr2_1_pnf_per_bit_persisit), .pass(ddr2_1_test_pass), .fail(ddr2_1_test_fail),
    .test_complete(ddr2_1_test_complete), .mem_clk(DDR2_1_clk[0]), .mem_clk_n(DDR2_1_clk_n[0]),
    .mem_dq(DDR2_1_dq), .mem_dqs(DDR2_1_dqs));  // open: pnf_per_bit
  not inst64 (inst64_out, pllrst_start[1]);
  not inst66 (inst66_out, pllrst_start[0]);
  and inst3 (inst3_out, stream_rxen, pcie_read_32_open);
  rx_pll_top #(.bandwidth_type("AUTO"), .clk0_divide_by(1), .clk0_duty_cycle(50), .clk0_multiply_by(1), .clk0_phase_shift("0"), .clk1_divide_by(1), .clk1_duty_cycle(50), .clk1_multiply_by(1), .clk1_phase_shift("0"), .compensate_clock("CLK1"), .inclk0_input_frequency(6250), .intended_device_family("Cyclone IV GX"), .operation_mode("SOURCE_SYNCHRONOUS"), .scan_chain_mif_file("ip/pll_rx/pll_rx.mif"), .drct_c0_ndly(1), .drct_c1_ndly(2)) inst2 (
    .pll_inclk(LMS_MCLK2), .pll_areset(pllrst_start[1]), .pll_logic_reset_n(fpga_reset_n), .inv_c0(1'b0),
    .clk_ena({1'b1, FCLK_ENA[1]}), .drct_clk_en({2{drc_clk_en[1]}}), .rcnfg_clk(CLK50_FPGA_1),
    .rcnfig_areset(pllrst_start[1]), .rcnfig_en(pllcfg_start[1]), .rcnfig_data(pllcfg_data),
    .dynps_mode(pllcfg_phcfg_mode), .dynps_areset_n(inst64_out), .dynps_en(phcfg_start[1]),
    .dynps_tst(pllcfg_phcfg_tst), .dynps_dir(phcfg_updn), .dynps_cnt_sel(cnt_ind[2:0]),
    .dynps_phase(cnt_phase[9:0]), .dynps_step_size(pllcfg_auto_phcfg_step[9:0]),
    .smpl_cmp_done(rx_path_smpl_cmp_done), .smpl_cmp_error(rx_path_smpl_cmp_err), .c0(LMS_FCLK2),
    .c1(MCLK2RX_pll_d), .pll_locked(rxpll_locked), .rcnfig_status(rx_reconfig_status),
    .dynps_done(rxpll_dynps_done), .dynps_status(rxpll_dynps_status), .smpl_cmp_en(rxpll_smpcmp_en),
    .busy(rxpllcfg_busy));  // open: dynps_busy
  tx_pll_top #(.bandwidth_type("AUTO"), .clk0_divide_by(1), .clk0_duty_cycle(50), .clk0_multiply_by(1), .clk0_phase_shift("0"), .clk1_divide_by(1), .clk1_duty_cycle(50), .clk1_multiply_by(1), .clk1_phase_shift("0"), .compensate_clock("CLK1"), .inclk0_input_frequency(6250), .intended_device_family("Cyclone IV GX"), .operation_mode("SOURCE_SYNCHRONOUS"), .scan_chain_mif_file("ip/pll_tx/pll_tx.mif"), .drct_c0_ndly(1), .drct_c1_ndly(2)) inst14 (
    .pll_inclk(LMS_MCLK1), .pll_areset(pllrst_start[0]), .pll_logic_reset_n(fpga_reset_n), .inv_c0(1'b0),
    .clk_ena({1'b1, FCLK_ENA[0]}), .drct_clk_en({2{drc_clk_en[0]}}), .rcnfg_clk(CLK50_FPGA_1),
    .rcnfig_areset(pllrst_start[0]), .rcnfig_en(pllcfg_start[0]), .rcnfig_data(pllcfg_data),
    .dynps_areset_n(inst66_out), .dynps_mode(pllcfg_phcfg_mode), .dynps_en(phcfg_start[0]),
    .dynps_tst(pllcfg_phcfg_tst), .dynps_dir(phcfg_updn), .dynps_cnt_sel(cnt_ind[2:0]),
    .dynps_phase(cnt_phase[9:0]), .dynps_step_size(pllcfg_auto_phcfg_step[9:0]),
    .smpl_cmp_done(rx_path_smpl_cmp_done), .smpl_cmp_error(rx_path_smpl_cmp_err), .c0(LMS_FCLK1),
    .c1(lmlclk), .pll_locked(mclk1tx_locked), .rcnfig_status(tx_reconfig_status),
    .dynps_done(txpll_dynps_done), .dynps_status(txpll_dynps_status), .smpl_cmp_en(txpll_smpcmp_en),
    .busy(txpllcfg_busy));  // open: dynps_busy
  sync_reg inst18 (
    .clk(MCLK2RX_pll_d), .reset_n(rxpll_locked), .async_in(inst3_out), .sync_out(stream_rxen_mclk2rxpll));
  tx_path_top #(.dev_family("Cyclone IV GX"), .iq_width(12), .pct_size_w(16), .n_buff(4), .in_pct_data_w(32), .out_pct_data_w(64), .decomp_fifo_size(9)) inst20 (
    .pct_wrclk(pcie_bus_clk), .iq_rdclk(lmlclk), .reset_n(stream_rxen_mclk2rxpll),
    .en(stream_rxen_mclk2rxpll), .rx_sample_clk(MCLK2RX_pll_d), .rx_sample_nr(rx_path_smpl_nr_cnt),
    .pct_sync_dis(lte_synch_dis), .pct_loss_flg_clr(lte_txpct_loss_clr), .mode(lml_mode),
    .trxiqpulse(lml_trxiq_pulse), .ddr_en(lml_ddr_en), .mimo_en(lte_mimo_en), .ch_en(lte_ch_en[1:0]),
    .fidm(1'b0), .sample_width(lte_smpl_width), .in_pct_wrreq(tx_outfifo_wrreq),
    .in_pct_data(tx_outfifo_data), .pct_loss_flg(pct_buff_aclr), .DIQ_h(tx_path_h), .DIQ_l(tx_path_l),
    .in_pct_full(inst20_in_pct_full));  // open: DIQ, fsync
  not inst11 (inst11_out, stream_rxen_mclk2rxpll);
  not inst10 (inst10_out, stream_sw_rdy);
  pcie_top inst15 (
    .inclk_125(CLK125_FPGA), .pcie_perstn(PCIE_PERSTn), .pcie_refclk(PCIE_REFCLK), .pcie_rx(PCIE_HSO),
    .tx_fifo32_aclr(inst11_out), .tx_fifo32_wrclk(MCLK2RX_pll_d), .tx_fifo32_wr(rxpct_outfifowr),
    .tx_fifo32_data(rx_pct_data), .rx_fifo32_wfull(inst10_out), .exfifo_clk(CLK100_FPGA),
    .exfifo_of_d(exfifo_of_d), .exfifo_of_wr(exfifo_of_wr), .exfifo_if_rd(exfifo_if_rd),
    .stream_rx_en(stream_rxen_mclk2rxpll), .pcie_tx(PCIE_HSI_IC), .pcie_bus_clk(pcie_bus_clk),
    .tx_fifo32_wusedw(pcie_tx_fifo32_wusedw), .tx_fifo32_wfull(pcie_tx_fifo32_wfull),
    .rx_fifo32_wr(pcie_tx_fifo32_wr), .rx_fifo32_data(pcie_tx_fifo32_data),
    .rx_fifo32_reset_req(rx_fifo_reset_req), .exfifo_of_wrfull(exfifo_of_wrfull), .exfifo_if_d(exfifo_if_d),
    .exfifo_if_rdempty(exfifo_if_rdempty), .read_32_open(pcie_read_32_open));  // open: user_led
  not inst29 (tx_outfifo_rdy, inst20_in_pct_full);
  or inst49 (inst49_out, rxpll_smpcmp_en, txpll_smpcmp_en);
  stream_switch #(.data_width(32), .wfm_fifo_wrusedw_size(10), .wfm_limit(4096)) inst31 (
    .clk(pcie_bus_clk), .reset_n(fpga_reset_n), .data_in(pcie_tx_fifo32_data),
    .data_in_valid(pcie_tx_fifo32_wr), .dest_sel(wfm_load), .tx_fifo_rdy(tx_outfifo_rdy),
    .wfm_rdy(wfm_player_rdy), .wfm_fifo_wrusedw(wfm_player_wrusedw), .wfm_fifo_wfull(wfm_infifo_wfull),
    .data_in_rdy(stream_sw_rdy), .tx_fifo_wr(tx_outfifo_wrreq), .tx_fifo_data(tx_outfifo_data),
    .wfm_fifo_wr(wfm_wr), .wfm_data(wfm_data));
  txiqmux #(.diq_width(12)) inst12 (
    .clk(lmlclk), .reset_n(mclk1tx_locked), .test_ptrn_en(tx_ptrn_en), .test_ptrn_fidm(1'b0),
    .mux_sel(wfm_play), .tx_diq_h(tx_path_h), .tx_diq_l(tx_path_l), .wfm_diq_h(dd_iq_h[12:0]),
    .wfm_diq_l(dd_iq_l[12:0]), .diq_h(ddmux_h), .diq_l(ddmux_l));
  rx_path_top #(.dev_family("Cyclone IV GX"), .iq_width(12), .invert_input_clocks("ON"), .smpl_buff_rdusedw_w(11), .pct_buff_wrusedw_w(12)) inst7 (
    .clk(MCLK2RX_pll_d), .reset_n(stream_rxen_mclk2rxpll), .test_ptrn_en(rx_ptrn_en),
    .sample_width(lte_smpl_width), .mode(lml_mode), .trxiqpulse(lml_trxiq_pulse), .ddr_en(lml_ddr_en),
    .mimo_en(lte_mimo_en), .ch_en(lte_ch_en[1:0]), .fidm(1'b0), .DIQ(LMS_DIQ2_D), .fsync(LMS_DIQ2_IQSEL2),
    .pct_fifo_wusedw(pcie_tx_fifo32_wusedw), .clr_smpl_nr(lte_clr_smpl_nr), .ld_smpl_nr(1'b0),
    .smpl_nr_in({64{1'b0}}), .tx_pct_loss(pct_buff_aclr), .tx_pct_loss_clr(lte_txpct_loss_clr),
    .smpl_cmp_start(inst49_out), .smpl_cmp_length(pllcfg_auto_phcfg_smpls), .pct_fifo_wrreq(rxpct_outfifowr),
    .pct_fifo_wdata(rx_pct_data), .smpl_nr_cnt(rx_path_smpl_nr_cnt), .smpl_cmp_done(rx_path_smpl_cmp_done),
    .smpl_cmp_err(rx_path_smpl_cmp_err));  // open: smpl_fifo_wrreq_out
  pllcfg_top #(.n_pll(2)) inst19 (
    .sdinA(FPGA_SPI0_MOSI), .sclkA(FPGA_SPI0_SCLK), .senA(spi_enables[1]), .lreset(fpga_reset_n),
    .mreset(fpga_reset_n), .pllcfg_busy({1'b0, pllcfg_busy}), .pllcfg_done({1'b1, pllcfg_done}),
    .pll_lock({rxpll_locked, mclk1tx_locked}), .auto_phcfg_done({rxpll_dynps_done, txpll_dynps_done}),
    .auto_phcfg_err({rxpll_dynps_status, txpll_dynps_status}), .sdoutA(pllcfg_sdoutA),
    .phcfg_mode(pllcfg_phcfg_mode), .phcfg_tst(pllcfg_phcfg_tst), .phcfg_start(phcfg_start),
    .pllcfg_start(pllcfg_start), .pllrst_start(pllrst_start), .phcfg_updn(phcfg_updn), .cnt_ind(cnt_ind),
    .cnt_phase(cnt_phase), .pllcfg_data(pllcfg_data), .auto_phcfg_smpls(pllcfg_auto_phcfg_smpls),
    .auto_phcfg_step(pllcfg_auto_phcfg_step));  // open: sdinB, sclkB, senB, oenA, sdoutB, oenB
  or inst21 (pllcfg_busy, rxpllcfg_busy, txpllcfg_busy);
  lms7002_ddout #(.dev_family("dev_family"), .iq_width(12)) inst13 (
    .clk(lmlclk), .reset_n(mclk1tx_locked), .data_in_h(ddmux_h), .data_in_l(ddmux_l), .txiq(LMS_DIQ1_D),
    .txiqsel(LMS_DIQ1_IQSEL));
  not inst24 (pllcfg_done, pllcfg_busy);

  // Other names for the same wires on the sheet: clk_fpga2 = CLK50_FPGA_1; DIQ2_RXD[11:0] = LMS_DIQ2_D;
  //   ENABLE_RXIQSEL_2 = LMS_DIQ2_IQSEL2; fpga_reset = EXT_GND;
  //   GPIO (some bits) = {TX2_2_LB_SH, TX2_2_LB_H, TX1_2_LB_SH, TX1_2_LB_H}; MCLK1TX = LMS_MCLK1; MCLK2RX = LMS_MCLK2;
  //   MCLK2RX_pll = LMS_FCLK2; spi1_ss[1:0] = {FPGA_SPI1_ADF_SS, FPGA_SPI1_DAC_SS}; spi_enables[0] = FPGA_SPI0_LMS_SS;
  //   spi_lms_external_MOSI = FPGA_SPI0_MOSI; spi_lms_external_SCLK = FPGA_SPI0_SCLK

  // Notes on the sheet:
  //   PLL`s and pll control
  //   General I/O, clock pins, ect
  //   Panel LEDS
  //   Onboard LEDs
  //   LTE packet synchronization, receive and transmit
  //   FPGA internal SPI
  //   NIOS II CPU
  //   PCIE bus
  //   FPGA Test logic
  //   DESCRIPTION
  //   BOARD
  //   LimeSDR - PCIE v1r3
  //   DATE
  //   2017-05-25
  //   AUTHOR
  //   Lime Microsystems
  //   REVISION
  //   v1r0
endmodule
